# EAGLE design PCB_Schematic_ECE477 (EAGLE 7.4.0)
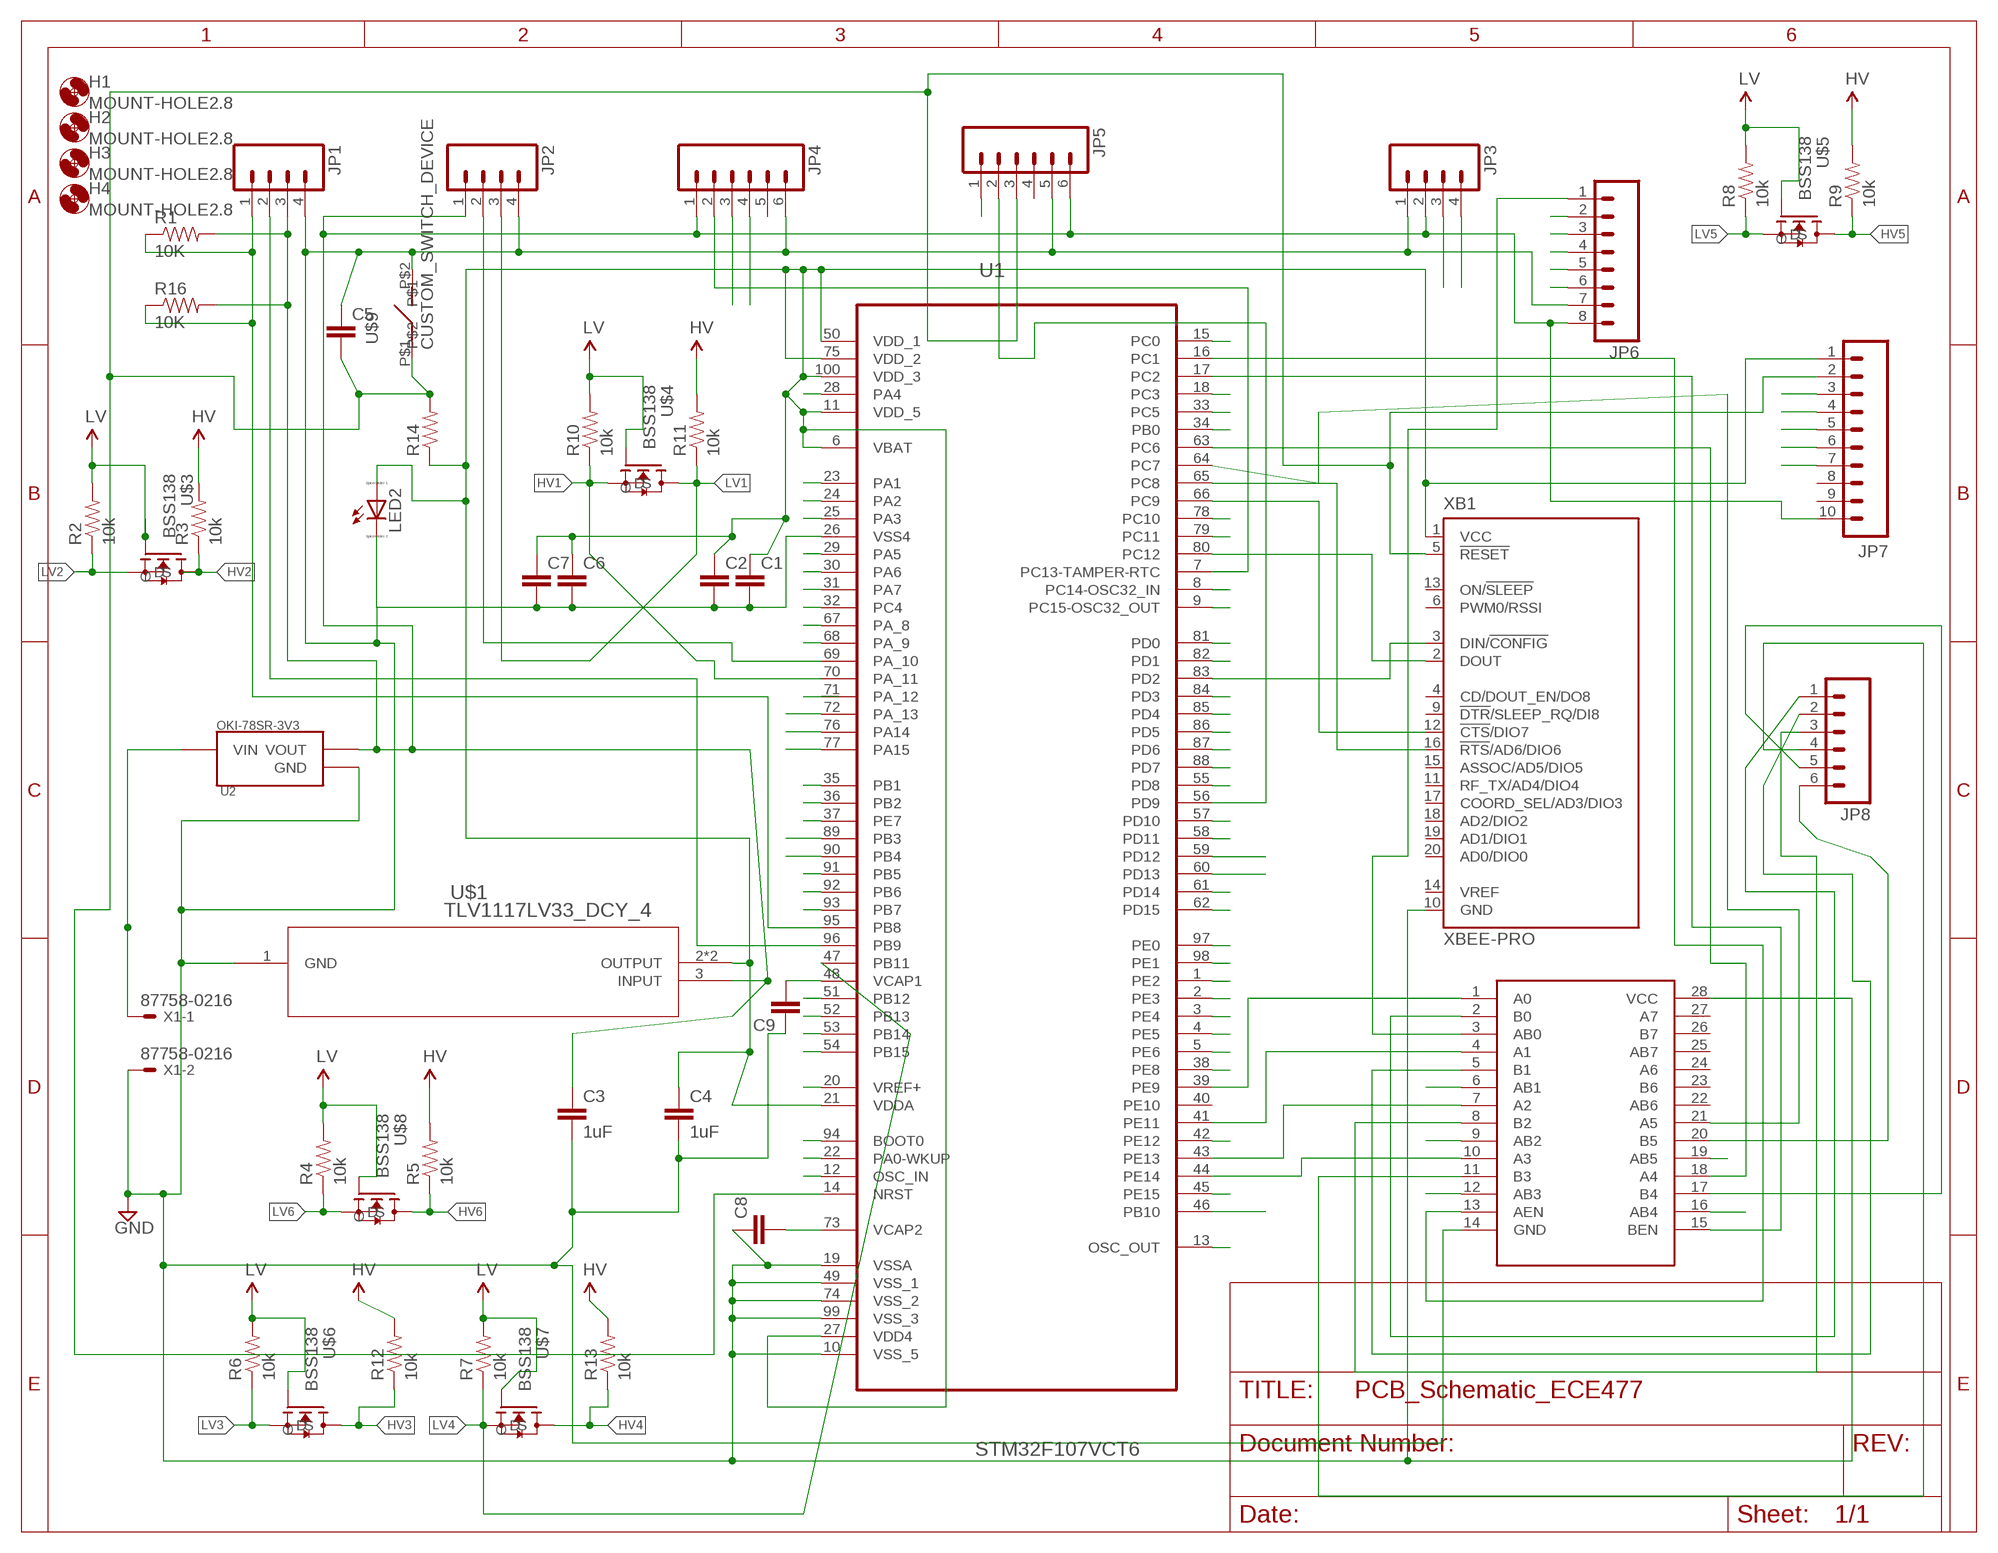
[diagram p0: schematic, sheet 1]

## Parts
C1  CAP1206  [1206]
C2  CAP1206  [1206]
C3  1uF  CAP1206  [1206]
C4  1uF  CAP1206  [1206]
C5  CAP1206  [1206]
C6  CAP1206  [1206]
C7  CAP1206  [1206]
C8  CAP1206  [1206]
C9  CAP1206  [1206]
H1  MOUNT-HOLE2.8  [2,8]
H2  MOUNT-HOLE2.8  [2,8]
H3  MOUNT-HOLE2.8  [2,8]
H4  MOUNT-HOLE2.8  [2,8]
JP1  M04PTH  [1X04]
JP2  M04PTH  [1X04]
JP3  M04PTH  [1X04]
JP4  M06SILK_FEMALE_PTH  [1X06]
JP5  M06SILK_FEMALE_PTH  [1X06]
JP6  M08SILK_FEMALE_PTH  [1X08]
JP7  M10SILK_FEMALE_PTH  [1X10]
JP8  M06SILK_FEMALE_PTH  [1X06]
LED2  LED_E  [LED_1206]
R1  10K  RESISTOR1206  [1206]
R2  10k  RESISTOR1206  [1206]
R3  10k  RESISTOR1206  [1206]
R4  10k  RESISTOR1206  [1206]
R5  10k  RESISTOR1206  [1206]
R6  10k  RESISTOR1206  [1206]
R7  10k  RESISTOR1206  [1206]
R8  10k  RESISTOR1206  [1206]
R9  10k  RESISTOR1206  [1206]
R10  10k  RESISTOR1206  [1206]
R11  10k  RESISTOR1206  [1206]
R12  10k  RESISTOR1206  [1206]
R13  10k  RESISTOR1206  [1206]
R14  RESISTOR1206  [1206]
R16  10K  RESISTOR1206  [1206]
U1  STM32F107VCT6  [QFP50P1600X1600X160-100N]
U2  OKI-78SR_3V3_SMPS  [SMPS_MODULE]
U$1  TLV1117LV33_DCY_4  [DCY4]
U$2  MUX_DEVMUX_VAR_1  [QSOP28]
U$3  BSS138  [BSS138]
U$4  BSS138  [BSS138]
U$5  BSS138  [BSS138]
U$6  BSS138  [BSS138]
U$7  BSS138  [BSS138]
U$8  BSS138  [BSS138]
U$9  CUSTOM_SWITCH_DEVICE  [CUSTOM_SWITCH_PACKAGE]
X1  87758-0216  [87758-0216]
XB1  XBEE-PRO  [XBEE-PRO]

## Nets
GND: C1.2 C2.2 C3.2 C4.2 C5.1 C6.2 C7.2 C8.1 C9.1 JP1.4 JP2.4 JP3.1 JP4.6 JP5.5 JP6.7 LED2.C U1.10(VSS_5) U1.19(VSSA) U1.26(VSS4) U1.49(VSS_1) U1.74(VSS_2) U1.99(VSS_3) U2.GND U$1.1(GND) U$2.14(GND) U$2.28(VCC) U$9.P$2 X1.2 XB1.10(GND)
HV: C3.1 JP1.3 JP2.1 JP3.2 JP4.1 JP5.6 JP6.8 JP7.10 R1.2 R3.2 R5.2 R9.2 R11.2 R12.2 R13.2 R16.2 U2.VOUT U$1.3(INPUT)
HV1: R10.1 U1.70(PA_11) U$4.S
HV2: JP3.3 R3.1 U$3.D
HV3: JP4.3 R12.1 U$6.D
HV4: JP4.4 R13.1 U$7.D
HV5: JP5.1 R9.1 U$5.D
HV6: JP3.4 R5.1 U$8.D
LV: R2.2 R4.2 R6.2 R7.2 R8.2 R10.2 U$3.G U$4.G U$5.G U$6.G U$7.G U$8.G
LV1: JP2.3 R11.1 U$4.D
LV2: R2.1 U1.59(PD12) U$3.S
LV3: R6.1 U1.46(PB10) U$6.S
LV4: R7.1 U1.47(PB11) U$7.S
LV5: R8.1 U1.55(PD8) U$5.S
LV6: R4.1 U1.60(PD13) U$8.S
N$1: C8.2 U1.73(VCAP2)
N$2: JP2.2 U1.69(PA_10)
N$3: JP6.6 U$2.19(AB5)
N$4: JP1.2 U1.96(PB9)
N$5: JP6.2 U$2.6(AB1)
N$6: JP6.3 U$2.9(AB2)
N$7: JP1.1 R1.1 R16.1 U1.95(PB8)
N$8: JP5.2 U1.56(PD9)
N$9: JP4.2 U1.7(PC13-TAMPER-RTC)
N$10: C9.2 U1.48(VCAP1)
N$10_NTJRST: JP7.7 U1.90(PB4)
N$10_TCLK: JP7.6 U1.76(PA14)
N$10_TDI: JP7.3 U1.77(PA15)
N$10_TDO: JP7.5 U1.89(PB3)
N$10_TMS: JP7.4 U1.72(PA_13)
N$11: U2.VIN X1.1
N$12: U1.23(PA1)
N$13: U1.24(PA2)
N$14: U1.80(PC12) XB1.2(DOUT)
N$15: U1.25(PA3)
N$16: U1.66(PC9) XB1.12(!CTS!/DIO7)
N$17: U1.65(PC8) XB1.16(!RTS!/AD6/DIO6)
N$18: U1.83(PD2) XB1.3(DIN/!CONFIG)
N$19: U1.29(PA5)
N$20: U1.16(PC1) U$2.13(AEN)
N$21: U1.17(PC2) U$2.15(BEN)
N$22: U1.39(PE9) U$2.1(A0)
N$23: U1.41(PE11) U$2.4(A1)
N$24: U1.43(PE13) U$2.7(A2)
N$25: U1.30(PA6)
N$26: U1.44(PE14) U$2.10(A3)
N$27: U1.63(PC6) U$2.18(A4)
N$28: U1.64(PC7) U$2.21(A5)
N$29: JP8.1 U$2.2(B0)
N$30: JP8.2 U$2.5(B1)
N$31: JP8.3 U$2.8(B2)
N$32: JP8.4 U$2.11(B3)
N$33: JP8.5 U$2.17(B4)
N$34: JP8.6 U$2.20(B5)
N$35: JP6.1 U$2.3(AB0)
N$36: U1.31(PA7)
N$37: U1.32(PC4)
N$38: U1.67(PA_8)
N$39: U1.68(PA_9)
N$41: JP6.4 U$2.12(AB3)
N$42: JP6.5 U$2.16(AB4)
N$43: U1.35(PB1)
N$44: U1.36(PB2)
N$45: U1.37(PE7)
N$46: U1.91(PB5)
N$47: U1.92(PB6)
N$48: U1.93(PB7)
N$49: U1.51(PB12)
N$50: U1.52(PB13)
N$51: U1.53(PB14)
N$52: U1.54(PB15)
N$53: U1.20(VREF+)
N$54: U1.94(BOOT0)
N$55: U1.22(PA0-WKUP)
N$56: U1.12(OSC_IN)
N$57: U1.13(OSC_OUT)
N$58: U1.45(PE15)
N$59: U1.42(PE12)
N$60: U1.38(PE8)
N$61: U1.5(PE6)
N$62: U1.4(PE5)
N$63: U1.3(PE4)
N$64: U1.2(PE3)
N$65: U1.1(PE2)
N$66: U1.98(PE1)
N$67: U1.97(PE0)
N$68: U1.62(PD15)
N$69: U1.61(PD14)
N$70: U1.58(PD11)
N$71: U1.57(PD10)
N$72: U1.88(PD7)
N$73: U1.87(PD6)
N$74: U1.86(PD5)
N$75: U1.85(PD4)
N$76: U1.84(PD3)
N$77: U1.82(PD1)
N$78: U1.81(PD0)
N$79: U1.9(PC15-OSC32_OUT)
N$80: U1.8(PC14-OSC32_IN)
N$81: U1.79(PC11)
N$82: U1.78(PC10)
N$83: U1.34(PB0)
N$84: U1.33(PC5)
N$85: U1.18(PC3)
N$86: U1.15(PC0)
N$87: U1.28(PA4)
RESET_OUT: C5.2 JP5.3 JP7.2 R14.2 U1.14(NRST) U$9.P$1 XB1.5(!RESET)
VIN_MICRO_3.3: C1.1 C2.1 C4.1 C6.1 C7.1 JP7.1 LED2.A R14.1 U1.6(VBAT) U1.11(VDD_5) U1.21(VDDA) U1.27(VDD4) U1.50(VDD_1) U1.75(VDD_2) U1.100(VDD_3) U$1.2(OUTPUT) U$1.4(OUTPUT) XB1.1(VCC)
Unconnected: JP4.5 JP5.4 JP7.8 JP7.9 U1.40(PE10) U1.71(PA_12) U$2.22(AB6) U$2.23(B6) U$2.24(A6) U$2.25(AB7) U$2.26(B7) U$2.27(A7) XB1.4(CD/DOUT_EN/DO8) XB1.6(PWM0/RSSI) XB1.9(!DTR!/SLEEP_RQ/DI8) XB1.11(RF_TX/AD4/DIO4) XB1.13(ON/!SLEEP) XB1.14(VREF) XB1.15(ASSOC/AD5/DIO5) XB1.17(COORD_SEL/AD3/DIO3) XB1.18(AD2/DIO2) XB1.19(AD1/DIO1) XB1.20(AD0/DIO0)

## Library data of the parts
C1-C9 = SparkFun-Passives:CAP: Capacitor Standard 0603 ceramic capacitor, and 0.1" leaded capacitor.
H1-H4 = holes:MOUNT-HOLE: MOUNTING HOLE with drill center marker
JP1-JP3 = SparkFun-Connectors:M04: Header 4 Standard 4-pin 0.1" header. Use with straight break away headers (SKU : PRT-00116), right angle break away headers (PRT-00553), swiss pins (PRT-00743), machine pins (PRT-00117), and female headers (PRT-00115). Molex polarized connector foot print use with SKU : PRT-08231 with associated crimp pins and housings. 1MM SMD Version SKU: PRT-10208
JP4 JP5 JP8 = SparkFun-Connectors:M06: Header 6 Standard 6-pin 0.1" header. Use with straight break away headers (SKU : PRT-00116), right angle break away headers (PRT-00553), swiss pins (PRT-00743), machine pins (PRT-00117), and female headers (PRT-00115). Molex polarized connector foot print use with SKU : PRT-08094 with associated crimp pins and housings. NOTES ON THE VARIANTS LOCK and LOCK_LONGPADS... This footprint was designed to help hold the alignment of a through-hole component (i.e. 6-pin header) while soldering it into place. You may notice that each hole has been shifted either up or down by 0.005 of an inch from it's more standard position (which is a perfectly straight line). This slight alteration caused the pins (the squares in the middle) to touch the edges of the holes. Because they are alternating, it causes a "brace" to hold the component in place. 0.005 has proven to be the perfect amount of "off-center" position when using our standard breakaway headers. Although looks a little odd when you look at the bare footprint, once you have a header in there, the alteration is very hard to notice. Also,if you push a header all the way into place, it is covered up entirely on the bottom side. This idea of altering the position of holes to aid alignment will be further integrated into the Sparkfun Library for other footprints. It can help hold any component with 3 or more connection pins.; PROD_ID: CONN-08437
JP6 = SparkFun-Connectors:M08: Header 8 Standard 8-pin 0.1" header. Use with straight break away headers (SKU : PRT-00116), right angle break away headers (PRT-00553), swiss pins (PRT-00743), machine pins (PRT-00117), and female headers (PRT-00115).; PROD_ID: CONN-08438
JP7 = SparkFun-Connectors:M10: Header 10 Standard 10-pin 0.1" header. Use with straight break away headers (SKU : PRT-00116), right angle break away headers (PRT-00553), swiss pins (PRT-00743), machine pins (PRT-00117), and female headers (PRT-00115).; PROD_ID: CONN-11563
LED2 = eagle-ltspice:LED_E: LED Source: http://www.osram.convergy.de Source: www.luxeon.com Source: www.kingbright.com; SPICEMODEL: NONE; SPICEPREFIX: D; SPICETYPE: diode
R1-R14 R16 = SparkFun-Resistors:RESISTOR: Resistor Basic schematic elements and footprints for 0603, 1206, and PTH resistors.
U1 = ST Microelctronics_By_element14_Batch_1:STM32F107VCT6: ARM-based 32-bit MCU; MPN: STM32F107VCT6; OC_FARNELL: 1737141; OC_NEWARK: 25R9446; PACKAGE: LQFP-100; SUPPLIER: STMicroelectronics
U2 = OKI-78SR_3V3_SMPS:OKI-78SR_3V3_SMPS
U$1 = TLV1117LV33_DCY_4:TLV1117LV33_DCY_4; DATASHEETURL: http://www.ti.com/lit/gpn/TLV1117LV33; DESCRIPTION: 1A, Positive Fixed Voltage Low-Dropout Linear Regulator; FAMILY_NAME: SINGLE CHANNEL LDO; GENERIC_PART_NUMBER: TLV1117LV33; INDUSTRY_STD_PKG_TYPE: SOT-223; MANUFACTURER: Texas Instruments; MANUFACTURER_PART_NUMBER: tlv1117lv33_dcy_4; PACKAGE_DESIGNATOR: DCY; PIN_COUNT: 4; VENDOR: Texas Instruments
U$2 = QSOP28:MUX_DEV
U$3-U$8 = BSS138:BSS138: BSS138 N-Channel Logic Level Enhancement Mode Field Effect Transistor
U$9 = custom_switch:CUSTOM_SWITCH_DEVICE
X1 = con-molex:87758-0216: 2 Pin - 2mm Dual Row Single Wafer, Vertical T/H HDR Source: http://www.molex.com/pdm_docs/sd/877580616_sd.pdf; MPN: 87758-0216; OC_FARNELL: unknown; OC_NEWARK: 94M1513
XB1 = maxstream:XBEE: XBee (TM) /XBee-PRO(TM) OEM RF Modules Source: MaxStream, Inc. xbee_productmanual.pdf; MPN: XBP24-AWI-001; OC_FARNELL: 1337916; OC_NEWARK: 42M2667

## Board
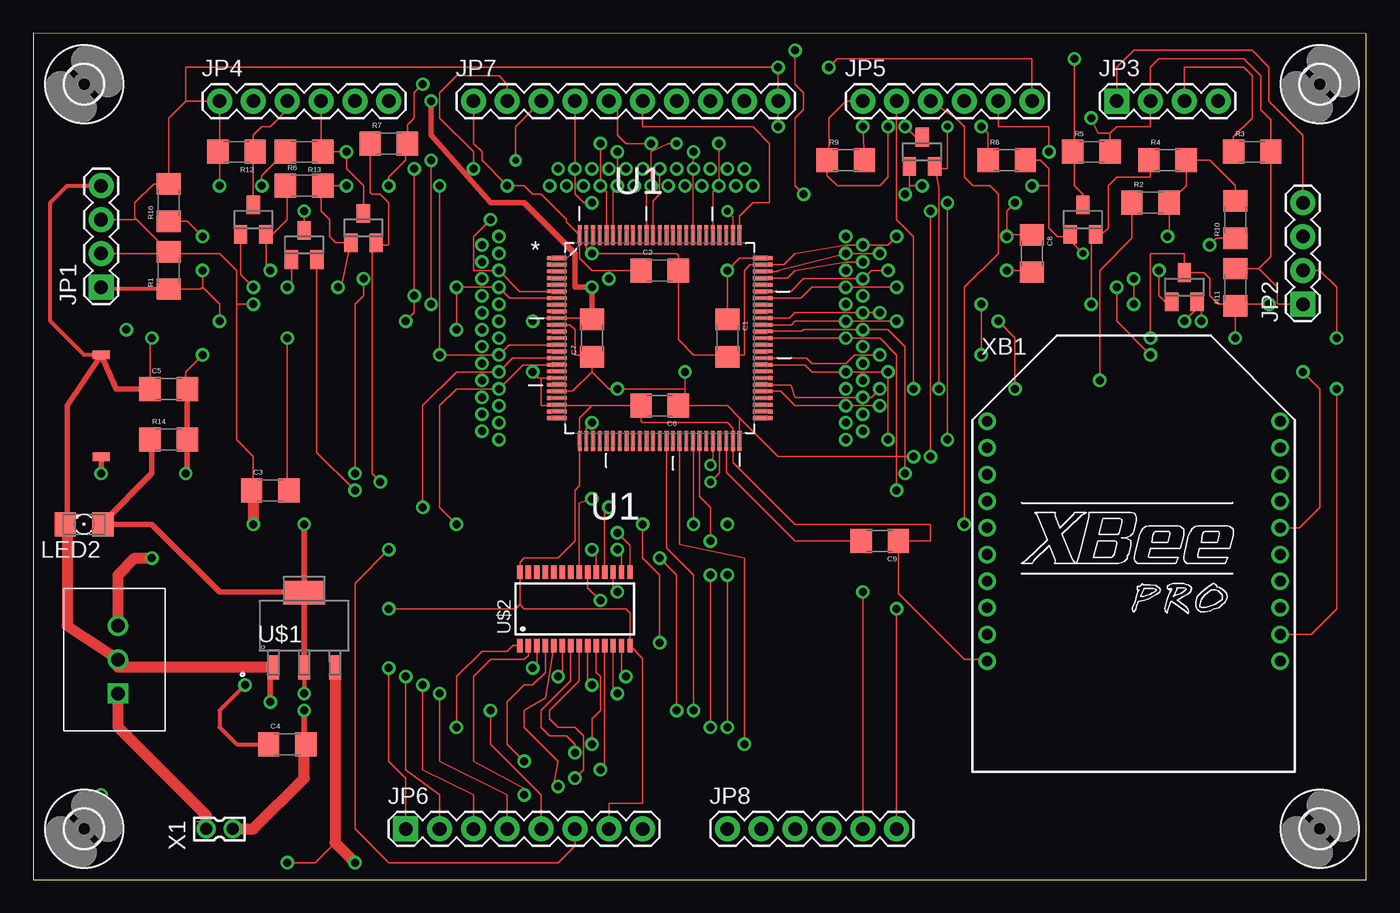
[diagram p1: board, top side]
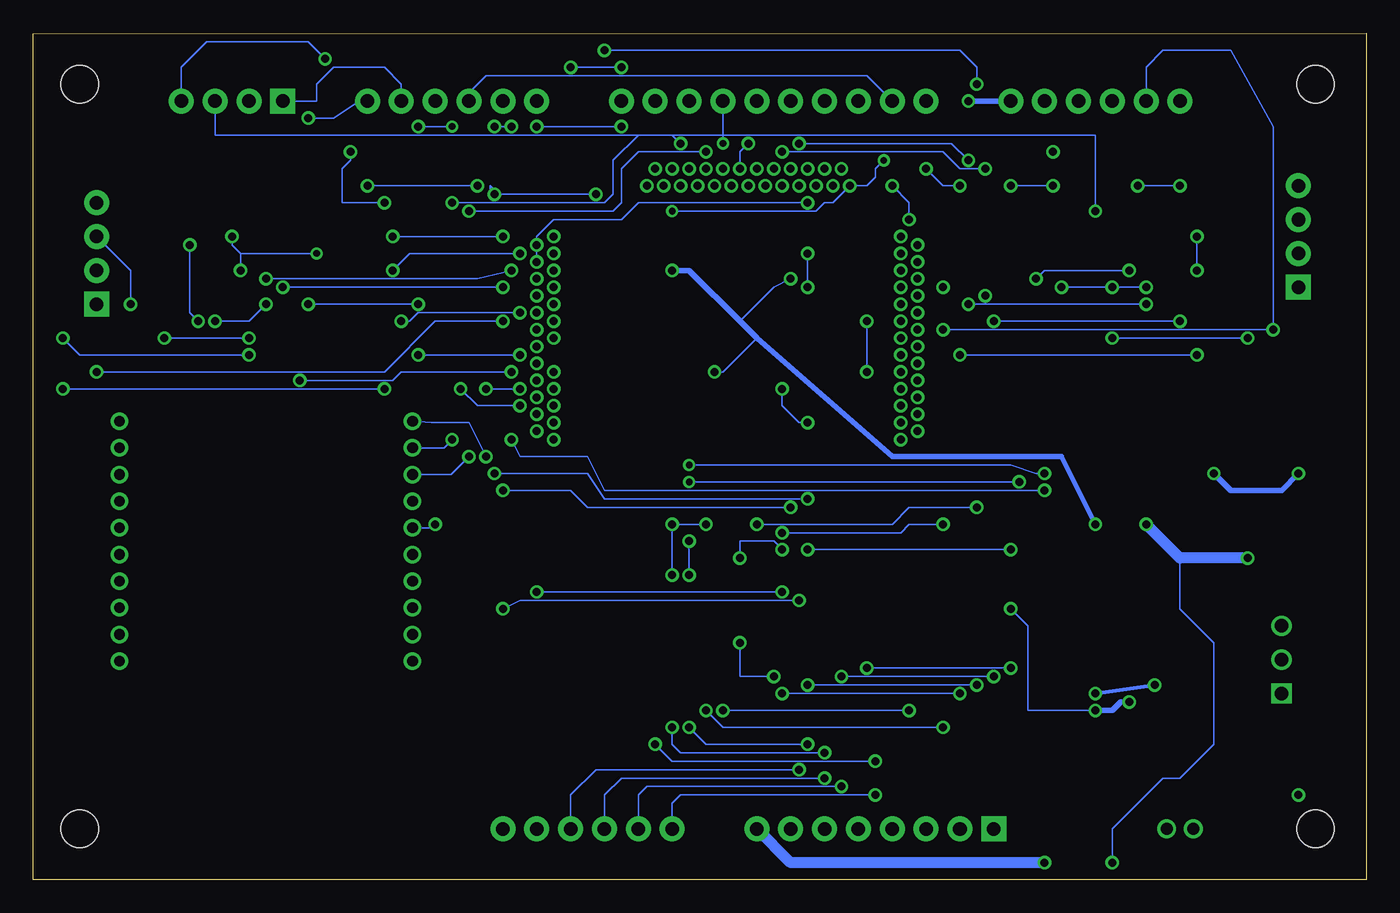
[diagram p2: board, bottom side, seen from below]

Size 100 x 63.51 mm. Coordinates in mm from the lower left corner, seen from the top.
Outline: 0,0 100,0 100,63.49 0,63.51 0,0
Copper layers (1*16): Top 0.035mm / dielectric 1.5mm / Bottom 0.035mm
Design rules "default": minimum track width 10mil, minimum drill 24mil, track to track 8mil, track to pad 8mil, pad to pad 8mil, via to via 8mil, smd to smd 8mil, copper to edge 40mil, drill to drill 8mil, minimum pad ring 10mil, minimum via ring 8mil, stop-mask expansion 4mil, vias tented up to drill 0mil, thermal gap 10mil

### Footprints (pad centres in the part's own frame; a part is rotated, then mirrored left to right if it is on the bottom)
1206 = smd 1.6 x 1.8: 1 -1.4,0; 2 1.4,0
2,8 = hole 2.8: 0,0
1X04 = drill 1.016 pad 1.88 square: 1 0,0 | drill 1.016 pad 1.88: 2 2.54,0; 3 5.08,0; 4 7.62,0
1X06 = drill 1.016 pad 1.88: 1 0,0; 2 2.54,0; 3 5.08,0; 4 7.62,0; 5 10.16,0; 6 12.7,0
1X08 = drill 1.016 pad 1.88 square: 1 0,0 | drill 1.016 pad 1.88: 2 2.54,0; 3 5.08,0; 4 7.62,0; 5 10.16,0; 6 12.7,0; 7 15.24,0; 8 17.78,0
1X10 = drill 1.016 pad 1.88: 1 0,0; 2 2.54,0; 3 5.08,0; 4 7.62,0; 5 10.16,0; 6 12.7,0; 7 15.24,0; 8 17.78,0; 9 20.32,0; 10 22.86,0
LED_1206 = smd 1.6 x 1.803: A -1.422,0; C 1.422,0
QFP50P1600X1600X160-100N = smd 1.473 x 0.279: 1 -7.722,5.994; 2 -7.722,5.512; 3 -7.722,5.004; 4 -7.722,4.496; 5 -7.722,3.988; 6 -7.722,3.505; 7 -7.722,2.997; 8 -7.722,2.489; 9 -7.722,2.007; 10 -7.722,1.499; 11 -7.722,0.991; 12 -7.722,0.508; 13 -7.722,0; 14 -7.722,-0.508; 15 -7.722,-0.991; 16 -7.722,-1.499; 17 -7.722,-2.007; 18 -7.722,-2.489; 19 -7.722,-2.997; 20 -7.722,-3.505; 21 -7.722,-3.988; 22 -7.722,-4.496; 23 -7.722,-5.004; 24 -7.722,-5.512; 25 -7.722,-5.994; 51 7.722,-5.994; 52 7.722,-5.512; 53 7.722,-5.004; 54 7.722,-4.496; 55 7.722,-3.988; 56 7.722,-3.505; 57 7.722,-2.997; 58 7.722,-2.489; 59 7.722,-2.007; 60 7.722,-1.499; 61 7.722,-0.991; 62 7.722,-0.508; 63 7.722,0; 64 7.722,0.508; 65 7.722,0.991; 66 7.722,1.499; 67 7.722,2.007; 68 7.722,2.489; 69 7.722,2.997; 70 7.722,3.505; 71 7.722,3.988; 72 7.722,4.496; 73 7.722,5.004; 74 7.722,5.512; 75 7.722,5.994 | smd 0.279 x 1.473: 26 -5.994,-7.722; 27 -5.512,-7.722; 28 -5.004,-7.722; 29 -4.496,-7.722; 30 -3.988,-7.722; 31 -3.505,-7.722; 32 -2.997,-7.722; 33 -2.489,-7.722; 34 -2.007,-7.722; 35 -1.499,-7.722; 36 -0.991,-7.722; 37 -0.508,-7.722; 38 0,-7.722; 39 0.508,-7.722; 40 0.991,-7.722; 41 1.499,-7.722; 42 2.007,-7.722; 43 2.489,-7.722; 44 2.997,-7.722; 45 3.505,-7.722; 46 3.988,-7.722; 47 4.496,-7.722; 48 5.004,-7.722; 49 5.512,-7.722; 50 5.994,-7.722; 76 5.994,7.722; 77 5.512,7.722; 78 5.004,7.722; 79 4.496,7.722; 80 3.988,7.722; 81 3.505,7.722; 82 2.997,7.722; 83 2.489,7.722; 84 2.007,7.722; 85 1.499,7.722; 86 0.991,7.722; 87 0.508,7.722; 88 0,7.722; 89 -0.508,7.722; 90 -0.991,7.722; 91 -1.499,7.722; 92 -2.007,7.722; 93 -2.489,7.722; 94 -2.997,7.722; 95 -3.505,7.722; 96 -3.988,7.722; 97 -4.496,7.722; 98 -5.004,7.722; 99 -5.512,7.722; 100 -5.994,7.722
SMPS_MODULE = drill 1: GND 0,0; VOUT 2.54,0 | drill 1 square: VIN -2.54,0
DCY4 = smd 0.889 x 1.778: 1 -2.311,-3.118; 2 0,-3.118; 3 2.311,-3.118 | smd 3.15 x 1.778: 4 0,2.483
QSOP28 = smd 0.4 x 1: 1 -4.128,-2.75; 2 -3.493,-2.75; 3 -2.858,-2.75; 4 -2.223,-2.75; 5 -1.587,-2.75; 6 -0.952,-2.75; 7 -0.317,-2.75; 8 0.318,-2.75; 9 0.953,-2.75; 10 1.588,-2.75; 11 2.223,-2.75; 12 2.858,-2.75; 13 3.493,-2.75; 14 4.128,-2.75; 15 4.128,2.75; 16 3.493,2.75; 17 2.858,2.75; 18 2.223,2.75; 19 1.588,2.75; 20 0.953,2.75; 21 0.318,2.75; 22 -0.317,2.75; 23 -0.952,2.75; 24 -1.587,2.75; 25 -2.223,2.75; 26 -2.858,2.75; 27 -3.493,2.75; 28 -4.128,2.75
BSS138 = smd 1 x 1.4: D 0,1.1; G -0.95,-1.1; S 0.95,-1.1
CUSTOM_SWITCH_PACKAGE = smd 0.635 x 1.27: P$1 -3.81,0; P$2 3.81,0
87758-0216 = drill 0.9 pad 1.27: 1 0,-1; 2 0,1
XBEE-PRO = drill 0.8 pad 1.27: 1 -11,9; 2 -11,7; 3 -11,5; 4 -11,3; 5 -11,1; 6 -11,-1; 7 -11,-3; 8 -11,-5; 9 -11,-7; 10 -11,-9; 11 11,-9; 12 11,-7; 13 11,-5; 14 11,-3; 15 11,-1; 16 11,1; 17 11,3; 18 11,5; 19 11,7; 20 11,9

### Placement (x,y rotation side)
C1  52.07,40.64 270 top
C2  46.99,45.72 0 top
C3  17.78,29.21 0 top
C4  19.05,10.16 0 top
C5  10.16,36.83 0 top
C6  46.99,35.56 180 top
C7  41.91,40.64 90 top
C8  74.93,46.99 270 top
C9  63.5,25.4 180 top
H1  3.81,59.69 0 top
H2  3.81,3.81 0 top
H3  96.52,59.69 0 top
H4  96.52,3.81 0 top
JP1  5.08,44.45 90 top
JP2  95.25,43.18 90 top
JP3  81.28,58.42 0 top
JP4  13.97,58.42 0 top
JP5  62.23,58.42 0 top
JP6  27.94,3.81 0 top
JP7  33.02,58.42 0 top
JP8  52.07,3.81 0 top
LED2  3.81,26.67 180 top
R1  10.16,45.72 90 top
R2  83.82,50.8 0 top
R3  91.44,54.61 0 top
R4  85.09,53.98 0 top
R5  79.38,54.61 0 top
R6  20.32,52.07 0 top
R7  26.67,55.24 0 top
R8  73.03,53.98 0 top
R9  60.96,53.98 0 top
R10  90.17,49.53 90 top
R11  90.17,44.45 90 top
R12  15.24,54.61 180 top
R13  20.32,54.61 180 top
R14  10.16,33.02 0 top
R16  10.16,50.8 90 top
U1  46.99,40.64 0 top
U2  6.35,16.51 90 top
U$1  20.32,19.05 0 top
U$2  40.64,20.32 0 top
U$3  20.32,47.62 0 top
U$4  86.36,44.45 0 top
U$5  66.67,54.61 0 top
U$6  16.51,49.53 0 top
U$7  24.77,48.9 0 top
U$8  78.74,49.53 0 top
U$9  5.08,35.56 90 top
X1  13.97,3.81 270 top
XB1  82.55,25.4 0 top

### Tracks (layer width: path | path; a pad name or v marks a point on that pad's centre or on a via)
GND  (via drill 0.6)
  Top 0.127: JP6.7 43.18,5.71 45.72,5.71 45.72,16.62 U$2.14 44.77,20 44.45,20.32 36.83,20.32 36.51,20.64 | C5.1 8.76,40.51 v8.89,40.64 | v19.05,40.64 19.05,29.34 C3.2 | C7.2 41.81,42.14 U1.10 37.69,42.14 v37.47,41.91 | U1.99 41.48,47.42 v41.91,46.99 48.26,46.99 48.39,46.86 C2.2 48.39,40.51 49.53,39.37 51.94,39.37 C1.2 52.2,39.37 53.34,39.37 53.34,45.72 53.77,46.15 U1.74 56.31,46.15 57.15,46.99 60.96,47.62 64.14,47.62 v64.77,48.26 | 41.91,35.56 C6.2 45.59,34.42 45.72,34.29 52.07,34.29 52.5,33.86 U1.49 52.5,31.32 57.15,26.67 67.31,26.67 67.31,25.4 C9.1 64.9,21.46 69.85,16.51 71.44,16.51 XB1.10 | 41.91,35.56 41,34.65 U1.26 41,29.57 40.64,29.21 40.64,25.4 39.37,24.13 36.83,24.13 36.51,23.81 U$2.28 36.51,20.64 | v26.67,20.32 36.19,20.32 36.51,20.64 | JP2.4 95.25,55.88 92.71,58.42 92.71,60.96 91.44,62.23 82.55,62.23 81.28,60.96 JP3.1 | v73.66,50.8 73.03,50.16 v73.03,48.26 73.16,48.39 C8.1 | v76.2,54.61 76.2,56.52 72.39,56.52 JP5.5 | U1.19 38.1,37.64 | 38.1,37.64 37.92,37.64 v37.47,38.1 | 41.91,35.56 38.1,35.56 38.1,37.64
  Top 0.305: U$9.P$2 3.81,39.37 1.27,41.91 1.27,50.8 2.54,52.07 JP1.4
  Top 0.406: 17.78,15.93 v17.78,13.34 | C4.2 20.32,10.16 v20.32,12.7 | 2.54,26.67 2.54,35.56 U$9.P$2 6.22,36.83 C5.1 | v29.84,58.42 29.84,55.88 34.29,50.8 36.83,50.8 40.64,46.99 40.64,44.45 v41.91,44.45 C7.2
  Top 0.813: U$1.1 17.78,15.93 6.35,15.93 U2.GND 2.54,19.05 2.54,26.67 LED2.C | X1.2 16.51,3.81 20.32,7.62 20.32,10.03 C4.2
  Bottom 0.127: v8.89,40.64 v19.05,40.64 | v41.91,46.99 v41.91,44.45 | v20.32,12.7 25.4,12.7 25.4,19.05 v26.67,20.32 | v64.77,48.26 v73.03,48.26 | JP3.1 78.74,58.42 78.74,59.69 77.47,60.96 73.66,60.96 72.39,59.69 JP5.5 | v73.66,50.8 76.83,50.8 76.83,53.34 76.2,53.98 v76.2,54.61 | v37.47,38.1 v37.47,41.91
  Bottom 0.406: v17.78,13.34 18.41,13.34 19.05,12.7 v20.32,12.7 | JP4.6 v29.84,58.42
HV  (via drill 0.6)
  Top 0.127: JP1.3 7.75,49.53 | 7.75,49.53 R1.2 | 7.75,49.53 7.62,49.66 7.62,50.8 9.02,52.2 R16.2 10.16,57.15 11.43,58.42 | 10.16,46.99 13.97,46.99 15.24,45.72 15.24,33.02 16.51,31.75 16.51,29.34 C3.1 | v19.05,1.27 21.13,1.27 22.63,2.77 | R11.2 91.94,45.85 | 91.94,45.85 93.34,44.45 93.34,43.18 JP2.1 | 91.94,45.85 92.84,46.74 R3.2 92.84,57.02 92.08,57.78 92.08,60.33 90.81,61.59 84.45,61.59 83.82,60.96 JP3.2 83.82,56.52 81.28,56.52 80.78,56.01 | R5.2 80.78,56.01 | 80.78,56.01 79.88,56.01 v79.38,57.15 | 11.43,58.42 JP4.1 13.97,54.74 | 13.97,54.74 R12.2 | 11.43,58.42 11.43,60.96 v55.88,60.96 JP7.10 v55.88,56.52 | 13.97,54.74 v13.97,52.07 | v17.14,52.07 17.14,52.84 R13.2 | R9.2 v62.23,56.52 | JP5.6 74.93,61.59 60.33,61.59 v59.69,60.96
  Top 0.305: R1.2 10.16,46.99
  Top 0.813: U2.VOUT 6.35,22.86 7.62,24.13 v8.89,24.13 | C3.1 16.51,29.21 v16.51,26.67 | U$1.3 22.63,2.77 v24.13,1.27
  Bottom 0.127: 13.97,24.13 13.97,20.32 11.43,17.78 11.43,10.16 13.97,7.62 15.24,7.62 19.05,3.81 v19.05,1.27 | JP5.6 75.56,58.42 77.47,57.15 v79.38,57.15 | v13.97,52.07 v17.14,52.07 | v55.88,56.52 v62.23,56.52 | v59.69,60.96 v55.88,60.96
  Bottom 0.813: v8.89,24.13 13.97,24.13 v16.51,26.67 | v24.13,1.27 43.18,1.27 JP6.8
HV1  (via drill 0.6)
  Top 0.127: U1.70 56.84,44.15 57.78,45.09 62.23,45.09 62.87,45.72 v64.14,45.72 | v86.36,41.91 87.31,42.86 U$4.S 87.63,43.03 v87.63,41.91 | v82.55,43.18 v82.55,45.09 | R10.1 88.77,48.13 v88.27,47.62
  Bottom 0.127: v86.36,41.91 83.82,41.91 v82.55,43.18 | v82.55,45.09 66.67,45.09 v64.14,45.72 | v88.27,47.62 88.27,42.55 v87.63,41.91
HV2  (via drill 0.6)
  Top 0.127: R3.1 90.04,55.75 91.44,57.15 91.44,60.33 90.81,60.96 86.36,60.96 JP3.3 | v20.32,50.16 U$3.D
  Bottom 0.127: JP3.3 86.36,55.88 20.32,55.88 v20.32,50.16
HV3
  Top 0.127: JP4.3 19.05,57.78 17.78,56.52 17.14,56.52 16.51,55.88 16.51,54.74 R12.1 16.51,54.48 U$6.D
HV4  (via drill 0.6)
  Top 0.127: JP4.4 21.59,54.74 R13.1 v23.5,54.61 23.5,53.34 24.77,52.07 U$7.D
HV5  (via drill 0.6)
  Top 0.127: JP5.1 60.96,58.42 59.69,57.15 59.69,54.1 R9.1 59.56,52.84 60.33,52.07 63.5,52.07 64.14,52.7 v64.14,56.52 | U$5.D 66.21,55.71 v65.41,56.52
  Bottom 0.127: v64.14,56.52 v65.41,56.52
HV6  (via drill 0.6)
  Top 0.127: U$8.D 78.74,51.44 78.11,52.07 78.11,53.84 R5.1 78.11,54.74 v78.11,61.59
  Bottom 0.127: JP3.4 88.9,60.96 87,62.87 79.38,62.87 v78.11,61.59
LV  (via drill 0.5, 0.6)
  Top 0.127: U$4.G 84.92,43.35 84.45,43.81 v84.45,45.72 | v85.09,48.26 85.22,48.39 R2.2 86.49,52.07 R4.2 88.27,53.98 90.17,52.07 R10.2 | v78.74,46.99 77.79,47.94 U$8.G 77.62,48.26 76.83,48.26 76.2,48.9 76.2,52.07 | R8.2 75.56,53.98 76.2,53.34 76.2,52.07 | U$6.G 15.56,45.4 v16.51,44.45 | U$3.G 19.37,44.77 v19.05,44.45 | v22.86,44.45 23.18,44.77 U$7.G 22.69,47.8 22.23,48.26 22.23,49.53 21.59,50.16 21.59,51.94 R6.2 v23.5,52.07 | v26.67,52.07 26.67,52.7 27.94,53.98 27.94,55.12 R7.2 28.07,56.65 28.57,57.15 28.57,59.05 v29.21,59.69 | v57.15,62.23 57.15,59.69 57.78,59.05 57.78,57.78 57.15,57.15 57.15,52.07 v57.78,51.44 | 65.72,52.07 U$5.G 65.72,52.38 | 65.72,52.07 65.72,51.76 v65.41,51.44 | 65.72,52.07 v66.67,52.07 | 76.2,52.07 v74.93,52.07
  Bottom 0.127: v85.09,48.26 85.09,47.62 84.45,46.99 | 84.45,46.99 v84.45,45.72 | v78.74,46.99 84.45,46.99 | v16.51,44.45 v19.05,44.45 v22.86,44.45 | v23.5,52.07 v26.67,52.07 | v29.21,59.69 29.21,60.96 30.48,62.23 v57.15,62.23 | v57.78,51.44 65.09,51.44 65.72,52.07 65.72,51.76 v65.41,51.44 | v66.67,52.07 v74.93,52.07
LV1  (via drill 0.6)
  Top 0.127: R11.1 v90.17,40.64 | v83.82,40.64 83.82,46.99 86.36,46.99 U$4.D 87.8,45.55 88.27,45.09 88.27,43.81 88.9,43.18 v92.71,43.18
  Bottom 0.127: v90.17,40.64 v83.82,40.64 | v92.71,43.18 92.71,45.72 JP2.3
LV2  (via drill 0.6)
  Top 0.127: U1.59 57.89,38.63 58.42,38.1 v64.14,38.1 v64.14,33.02 | U$3.S 21.27,32.07 v24.13,29.21 | R2.1 82.42,48.13 80.01,45.72 v80.01,37.47
  Bottom 0.127: v24.13,29.21 57.15,29.21 58.42,31.75 63.5,31.75 v64.14,33.02 | v80.01,37.47 73.03,37.47 72.39,38.1 v64.14,38.1
LV3  (via drill 0.5, 0.6)
  Top 0.127: U1.46 50.98,31.29 v50.8,31.11 | v17.78,45.72 17.46,46.04 U$6.S 17.95,48.43 19.05,49.53 19.05,51.94 R6.1 | v24.77,45.09 24.77,43.81 24.13,43.18 v24.13,30.48
  Bottom 0.127: v50.8,31.11 26.67,31.11 24.77,30.48 v24.13,30.48 | v17.78,45.72 24.13,45.72 v24.77,45.09
LV4  (via drill 0.5, 0.6)
  Top 0.127: U1.47 51.49,30.53 v50.8,29.84 | v26.04,29.84 25.4,30.48 25.4,47.48 U$7.S 25.89,47.62 26.67,47.62 26.67,50.8 26.04,51.44 25.4,51.44 25.27,51.56 R7.1
  Bottom 0.127: v50.8,29.84 v26.04,29.84
LV5  (via drill 0.5, 0.6)
  Top 0.127: U1.55 56.06,36.65 57.15,35.56 v63.5,35.56 | v67.94,36.83 67.94,51.92 U$5.S 67.8,53.34 68.58,53.34 v68.58,56.52 | R8.1 71.62,56.01 v71.12,56.52
  Bottom 0.127: v63.5,35.56 66.67,35.56 v67.94,36.83 | v71.12,56.52 v68.58,56.52
LV6  (via drill 0.6)
  Top 0.127: U1.60 58.01,39.14 58.42,38.73 60.96,38.73 61.59,39.37 v63.5,39.37 | v71.12,39.37 v71.12,43.18 | v79.38,43.18 79.38,48.12 U$8.S 80.18,48.43 80.64,48.9 80.64,52.07 81.28,52.7 83.82,52.7 83.82,53.84 R4.1
  Bottom 0.127: v63.5,39.37 v71.12,39.37 | v71.12,43.18 v79.38,43.18
N$1  (via drill 0.6)
  Top 0.127: U1.73 55.8,45.64 55.88,45.72 60.96,46.99 v63.5,46.99 | v73.03,45.72 74.8,45.72 C8.2
  Bottom 0.127: v63.5,46.99 71.75,46.99 v73.03,45.72
N$2  (via drill 0.6)
  Top 0.127: U1.69 57.61,43.64 58.42,44.45 v64.77,44.45 | v81.28,44.45 81.28,41.91 v83.82,39.37 | v97.79,40.64 97.79,44.45 96.52,45.72 JP2.2
  Bottom 0.127: v64.77,44.45 v81.28,44.45 | v83.82,39.37 96.52,39.37 v97.79,40.64
N$3  (via drill 0.6)
  Top 0.127: JP6.6 40.64,2.54 39.37,1.27 26.67,1.27 24.13,3.81 24.13,22.23 v26.67,24.77 | U$2.19 42.23,24.45 v41.91,24.77
  Bottom 0.127: v26.67,24.77 v41.91,24.77
N$4  (via drill 0.6)
  Top 0.127: JP1.2 13.97,46.99 15.24,45.72 15.24,43.18 v16.51,43.18 | U1.96 43,51.61 42.55,52.07 v42.55,55.24 | v29.84,43.18 v29.84,53.98
  Bottom 0.127: v16.51,43.18 v29.84,43.18 | v29.84,53.98 31.11,55.24 v42.55,55.24
N$5  (via drill 0.6)
  Top 0.127: JP6.2 30.48,6.35 27.94,8.26 v27.94,15.24 | v39.37,15.24 39.69,15.56 U$2.6
  Bottom 0.127: v27.94,15.24 v39.37,15.24
N$6  (via drill 0.6)
  Top 0.127: JP6.3 33.02,6.35 29.21,8.26 v29.21,14.61 | v41.91,14.61 41.59,14.92 U$2.9
  Bottom 0.127: v29.21,14.61 v41.91,14.61
N$7  (via drill 0.6)
  Top 0.127: R16.1 11.56,49.4 v12.7,48.26 | R1.1 12.57,44.32 12.7,44.45 | 12.7,44.45 v12.7,45.72 | U1.95 43.48,51.74 43.81,52.07 v43.81,54.61 | v27.94,41.91 28.57,42.55 v28.57,43.81 v28.57,53.34 | v13.97,41.91 13.97,43.18 12.7,44.45
  Top 0.305: R1.1 5.21,44.32 JP1.1
  Bottom 0.127: v12.7,48.26 v12.7,45.72 | v43.81,54.61 31.75,54.61 30.48,53.34 v28.57,53.34 | 28.57,43.18 v28.57,43.81 | v27.94,41.91 v13.97,41.91
N$8  (via drill 0.6)
  Top 0.127: U1.56 56.84,37.13 57.15,36.2 62.87,36.2 v63.5,36.83 | v66.04,36.83 66.04,48.26 64.77,49.53 JP5.2
  Bottom 0.127: v63.5,36.83 v66.04,36.83
N$9  (via drill 0.6)
  Top 0.127: U1.7 35.74,43.64 34.92,44.45 v31.75,44.45 v31.75,41.27
  Bottom 0.127: v31.75,41.27 v6.99,41.27 6.99,56.52 10.16,62.23 15.24,62.23 16.51,60.96 JP4.2
N$10
  Top 0.127: U1.48 51.99,30.56 57.15,25.4 C9.2
N$10_NTJRST  (via drill 0.5)
  Top 0.127: U1.90 46,51.71 46.35,52.07 46.35,54.61 47.62,55.24 v48.26,55.24
  Bottom 0.127: v48.26,55.24 JP7.7
N$10_TCLK
  Top 0.127: U1.76 52.98,49.81 53.98,50.8 55.24,50.8 55.24,55.24 53.98,56.52 45.72,56.52 JP7.6
N$10_TDI  (via drill 0.5)
  Top 0.127: U1.77 52.5,49.73 v52.07,50.16 | JP7.3 36.2,56.52 v36.2,53.98
  Bottom 0.127: v52.07,50.16 41.27,50.16 40.64,50.8 40.01,50.8 38.73,52.07 37.47,52.07 36.83,52.7 36.83,53.34 v36.2,53.98
N$10_TDO  (via drill 0.6)
  Top 0.127: U1.89 46.48,50.93 46.99,51.44 v46.99,53.34 | v46.35,55.24 44.45,55.24 43.81,55.88 43.81,57.78 JP7.5
  Bottom 0.127: v46.99,53.34 46.99,54.61 v46.35,55.24
N$10_TMS  (via drill 0.6)
  Top 0.127: U1.72 56.57,45.14 57.15,45.72 60.96,46.35 v62.23,46.35 | JP7.4 40.64,51.44 41.27,50.8 v41.91,50.8
  Bottom 0.127: v41.91,50.8 54.61,50.8 55.88,49.53 60.96,49.53 62.23,48.26 v62.23,46.35
N$11
  Top 0.813: X1.1 12.97,4.81 6.35,11.43 U2.VIN
N$14  (via drill 0.6)
  Top 0.127: U1.80 50.98,51.61 51.44,52.07 v51.44,55.24 | v68.58,33.02 v68.58,50.8
  Bottom 0.127: XB1.2 69.2,32.4 v68.58,33.02 | v68.58,50.8 57.15,50.8 56.52,51.44 56.52,53.98 54.61,55.88 52.07,55.88 v51.44,55.24
N$16  (via drill 0.6)
  Top 0.127: U1.66 56.74,42.14 57.15,42.55 v63.5,42.55 | XB1.12 95.87,18.4 97.79,20.32 v97.79,36.83 | v73.66,36.83 73.66,40.64 v72.39,41.91
  Bottom 0.127: v97.79,36.83 v73.66,36.83 | v72.39,41.91 71.75,41.91 71.12,42.55 v63.5,42.55
N$17  (via drill 0.6)
  Top 0.127: U1.65 56.87,41.63 57.15,41.91 v64.77,41.91 | XB1.16 94.98,26.4 96.52,27.94 96.52,36.83 v95.25,38.1
  Bottom 0.127: v95.25,38.1 73.66,38.1 69.85,41.91 v64.77,41.91
N$18  (via drill 0.6)
  Top 0.127: U1.83 49.48,53.29 v49.53,54.61 | v67.31,31.75 v67.31,50.16
  Bottom 0.127: XB1.3 68.66,30.4 v67.31,31.75 | v67.31,50.16 56.52,50.16 55.88,50.8 55.88,53.34 54.61,54.61 v49.53,54.61
N$20  (via drill 0.6)
  Top 0.127: U$2.13 44.13,15.56 v44.45,15.24 | v46.99,17.78 46.99,22.86 45.72,24.13 v45.72,26.67 | U1.16 35.97,39.14 34.92,38.1 31.75,38.1 29.21,35.56 v29.21,27.94
  Bottom 0.127: v44.45,15.24 46.99,15.24 v46.99,17.78 | v45.72,26.67 35.56,26.67 34.29,27.94 v29.21,27.94
N$21  (via drill 0.6)
  Top 0.127: U$2.15 44.77,25.08 v43.81,26.04 | U1.17 36.73,38.63 34.92,36.83 31.75,36.83 30.48,35.56 30.48,27.94 v31.75,26.67
  Bottom 0.127: v43.81,26.04 34.92,26.04 34.29,26.67 v31.75,26.67
N$22  (via drill 0.6)
  Top 0.127: U$2.1 35.98,17.57 35.56,17.14 33.66,17.14 31.75,15.24 v31.75,11.43 | U1.39 47.5,24.89 49.53,22.86 v49.53,12.7
  Bottom 0.127: v31.75,11.43 48.26,11.43 v49.53,12.7
N$23  (via drill 0.6)
  Top 0.127: U$2.4 38.42,15.56 37.47,14.61 36.83,14.61 35.56,13.34 35.56,10.16 v36.83,8.89 | U1.41 48.49,25.17 53.34,24.13 v53.34,10.16
  Bottom 0.127: v36.83,8.89 52.07,8.89 v53.34,10.16
N$24  (via drill 0.6)
  Top 0.127: U$2.7 40.32,14.92 38.1,12.7 38.1,11.43 38.73,10.79 40.01,10.79 40.64,10.16 v40.64,9.53 | v52.07,11.43 v52.07,22.86 | v49.53,26.67 49.53,32.87 U1.43
  Bottom 0.127: v40.64,9.53 51.44,9.53 52.07,10.16 v52.07,11.43 | v52.07,22.86 v52.07,26.67 v49.53,26.67
N$26  (via drill 0.6)
  Top 0.127: U$2.10 42.23,15.56 42.55,15.24 42.55,12.7 41.91,12.06 v41.91,10.16 | v50.8,11.43 v50.8,22.86 | v50.8,25.4 50.8,27.94 49.99,28.75 U1.44
  Bottom 0.127: v41.91,10.16 49.53,10.16 v50.8,11.43 | v50.8,22.86 v50.8,25.4
N$27  (via drill 0.6)
  Top 0.127: U1.63 63.5,40.64 64.77,39.37 v64.77,29.21 | U$2.18 42.86,27.62 v43.18,27.94
  Bottom 0.127: v43.18,27.94 58.42,27.94 59.69,29.21 v64.77,29.21
N$28  (via drill 0.6)
  Top 0.127: U1.64 57.66,41.15 57.78,41.27 64.14,41.27 65.41,40.01 v65.41,30.48 | U$2.21 40.96,28.26 v41.91,28.57
  Bottom 0.127: v41.91,28.57 57.15,28.57 58.42,30.48 v65.41,30.48
N$29  (via drill 0.6)
  Top 0.127: v36.83,6.35 37.15,6.67 33.02,8.89 33.02,15.24 34.29,16.51 36.83,16.51 37.15,16.83 U$2.2
  Bottom 0.127: JP8.1 52.07,5.71 51.44,6.35 v36.83,6.35
N$30  (via drill 0.6)
  Top 0.127: v39.37,6.99 39.05,7.3 39.37,8.89 36.83,11.43 36.83,12.7 38.42,13.65 U$2.5
  Bottom 0.127: JP8.2 54.61,6.35 53.98,6.99 v39.37,6.99
N$31  (via drill 0.6)
  Top 0.127: 40.96,7.94 v40.64,7.62 41.27,8.26 41.27,10.79 40.64,11.43 39.37,11.43 38.73,12.06 38.73,12.7 40.96,14.92 U$2.8
  Bottom 0.127: JP8.3 57.15,6.35 55.88,7.62 v40.64,7.62
N$32  (via drill 0.6)
  Top 0.127: v42.55,8.26 42.86,8.57 U$2.11
  Bottom 0.127: JP8.4 59.69,6.35 57.78,8.26 v42.55,8.26
N$33  (via drill 0.6)
  Top 0.127: U$2.17 43.5,21.91 v43.81,21.59 | v62.23,21.59 JP8.5
  Bottom 0.127: v43.81,21.59 v62.23,21.59
N$34  (via drill 0.6)
  Top 0.127: 42.23,21.27 v42.55,20.95 41.59,21.91 U$2.20 | JP8.6 v64.77,20.32
  Bottom 0.127: v42.55,20.95 63.5,20.95 v64.77,20.32
N$35  (via drill 0.6)
  Top 0.127: JP6.1 27.94,7.62 26.67,8.89 v26.67,15.88 | U$2.3 37.78,16.19 v37.47,15.88
  Bottom 0.127: v26.67,15.88 v37.47,15.88
N$41  (via drill 0.6)
  Top 0.127: JP6.4 35.56,6.35 30.48,8.89 v30.48,13.97 | v43.81,13.97 43.5,14.29 U$2.12
  Bottom 0.127: v30.48,13.97 v43.81,13.97
N$42  (via drill 0.6)
  Top 0.127: JP6.5 38.1,6.35 34.29,10.16 v34.29,12.7 | v48.26,12.7 48.26,22.86 v46.99,24.13 | U$2.16 44.13,24.45 v43.81,24.77
  Bottom 0.127: v34.29,12.7 v48.26,12.7 | v46.99,24.13 46.99,25.4 44.45,25.4 v43.81,24.77
N$88  (via drill 0.6)
  other vias: 17.14,52.07
N$113  (via drill 0.6)
  other vias: 5.08,6.35
N$114  (via drill 0.6)
  other vias: 34.92,48.26
N$115  (via drill 0.6)
  other vias: 34.92,46.99
N$116  (via drill 0.6)
  other vias: 34.92,45.72
N$117  (via drill 0.6)
  other vias: 60.96,33.02
N$118  (via drill 0.6)
  other vias: 60.96,34.29
N$119  (via drill 0.6)
  other vias: 60.96,35.56
N$120  (via drill 0.6)
  other vias: 60.96,36.83
N$121  (via drill 0.6)
  other vias: 60.96,38.1
N$123  (via drill 0.6)
  other vias: 60.96,40.64
N$124  (via drill 0.6)
  other vias: 60.96,41.91
N$125  (via drill 0.6)
  other vias: 60.96,43.18
N$126  (via drill 0.6)
  other vias: 60.96,44.45
N$127  (via drill 0.6)
  other vias: 60.96,45.72
N$128  (via drill 0.6)
  other vias: 60.96,46.99
N$129  (via drill 0.6)
  other vias: 60.96,48.26
N$130  (via drill 0.6)
  other vias: 34.92,44.45
N$131  (via drill 0.6)
  other vias: 34.92,43.18
N$132  (via drill 0.6)
  other vias: 34.92,41.91
N$133  (via drill 0.6)
  other vias: 34.92,40.64
N$134  (via drill 0.6)
  other vias: 62.23,34.92
N$135  (via drill 0.6)
  other vias: 62.23,36.2
N$136  (via drill 0.6)
  other vias: 62.23,37.47
N$137  (via drill 0.6)
  other vias: 62.23,38.73
N$138  (via drill 0.6)
  other vias: 62.23,40.01
N$139  (via drill 0.6)
  other vias: 62.23,41.27
N$140  (via drill 0.6)
  other vias: 62.23,42.55
N$141  (via drill 0.6)
  other vias: 62.23,43.81
N$142  (via drill 0.6)
  other vias: 62.23,45.09
N$144  (via drill 0.6)
  other vias: 62.23,47.62
N$145  (via drill 0.6)
  other vias: 62.23,33.66
N$146  (via drill 0.6)
  other vias: 34.92,39.37
N$147  (via drill 0.6)
  other vias: 34.92,38.1
N$148  (via drill 0.6)
  other vias: 34.92,36.83
N$149  (via drill 0.6)
  other vias: 34.92,35.56
N$150  (via drill 0.6)
  other vias: 34.92,34.29
N$151  (via drill 0.6)
  other vias: 34.92,33.02
N$152  (via drill 0.6)
  other vias: 33.66,33.66
N$153  (via drill 0.6)
  other vias: 33.66,34.92
N$154  (via drill 0.6)
  other vias: 33.66,36.2
N$155  (via drill 0.6)
  other vias: 33.66,37.47
N$156  (via drill 0.6)
  other vias: 33.66,38.73
N$157  (via drill 0.6)
  other vias: 33.66,40.01
N$158  (via drill 0.6)
  other vias: 33.66,41.27
N$159  (via drill 0.6)
  other vias: 33.66,42.55
N$160  (via drill 0.6)
  other vias: 33.66,43.81
N$161  (via drill 0.6)
  other vias: 33.66,45.09
N$162  (via drill 0.6)
  other vias: 33.66,46.35
N$163  (via drill 0.6)
  other vias: 33.66,47.62
N$164  (via drill 0.6)
  other vias: 38.73,52.07
N$165  (via drill 0.6)
  other vias: 40.01,52.07
N$166  (via drill 0.6)
  other vias: 41.27,52.07
N$167  (via drill 0.6)
  other vias: 42.55,52.07
N$168  (via drill 0.6)
  other vias: 43.81,52.07
N$169  (via drill 0.6)
  other vias: 45.09,52.07
N$170  (via drill 0.6)
  other vias: 46.35,52.07
N$171  (via drill 0.6)
  other vias: 47.62,52.07
N$172  (via drill 0.6)
  other vias: 48.9,52.07
N$173  (via drill 0.6)
  other vias: 50.16,52.07
N$174  (via drill 0.6)
  other vias: 51.44,52.07
N$175  (via drill 0.6)
  other vias: 52.7,52.07
N$176  (via drill 0.6)
  other vias: 53.98,52.07
N$177  (via drill 0.6)
  other vias: 39.37,53.34
N$178  (via drill 0.6)
  other vias: 40.64,53.34
N$179  (via drill 0.6)
  other vias: 41.91,53.34
N$180  (via drill 0.6)
  other vias: 43.18,53.34
N$181  (via drill 0.6)
  other vias: 44.45,53.34
N$182  (via drill 0.6)
  other vias: 45.72,53.34
N$184  (via drill 0.6)
  other vias: 48.26,53.34
N$185  (via drill 0.6)
  other vias: 49.53,53.34
N$186  (via drill 0.6)
  other vias: 50.8,53.34
N$187  (via drill 0.6)
  other vias: 52.07,53.34
N$188  (via drill 0.6)
  other vias: 53.34,53.34
RESET_OUT  (via drill 0.6)
  Top 0.127: U1.14 35.69,40.13 34.92,39.37 v30.48,39.37 v30.48,52.07 | v12.7,39.37 11.43,38.1 11.43,36.96 C5.2 | v69.85,26.67 69.85,44.45 72.39,46.99 72.39,51.44 71.75,52.07 70.48,52.07 69.85,52.7 69.85,56.52 69.22,57.15 JP5.3 | v33.02,53.34 33.02,54.61 30.48,57.15 30.48,59.05 31.75,60.33 34.92,60.33 35.56,59.69 JP7.2
  Top 0.406: U$9.P$1 v5.08,30.48 | v11.43,30.48 11.56,30.48 R14.2 C5.2
  Bottom 0.127: v30.48,39.37 v12.7,39.37 | XB1.5 70.12,26.4 v69.85,26.67 | JP5.3 67.31,59.05 66.04,60.33 37.47,60.33 JP7.2 | v30.48,52.07 31.75,52.07 v33.02,53.34
  Bottom 0.406: v5.08,30.48 6.35,29.21 10.16,29.21 v11.43,30.48
VIN_MICRO_3.3  (via drill 0.6)
  Top 0.127: U1.21 40.46,36.65 41.91,38.1 | 41.91,38.1 C7.1 41.78,39.37 40.64,39.37 40.64,41.27 40.28,41.63 U1.11 | U1.75 52.98,46.63 v52.07,45.72 C1.1 | 48.9,35.56 C6.1 48.26,35.56 | 48.9,35.56 52.07,35.56 52.98,34.65 | U1.27 41.48,33.86 v41.91,34.29 | 48.9,36.83 v43.81,36.83 43.18,36.83 41.91,38.1 | 48.9,36.83 48.9,35.56 | 48.9,36.83 v48.9,38.1 | C2.1 43.18,45.72 | 43.18,45.72 41.91,45.72 41,46.63 U1.100 40.01,49.35 40.01,49.53 38.1,51.44 37.47,51.44 36.83,52.07 v35.56,52.07 33.66,53.98 33.66,54.61 33.02,55.24 JP7.1 | 43.18,45.72 v43.18,45.09 | 52.98,34.65 55.88,31.75 v66.04,31.75 | 71.44,34.29 XB1.1 | U1.50 52.98,34.65 | U1.6 36.5,44.15 34.92,45.72 33.02,45.72 33.02,48.26 v34.29,49.53
  Top 0.305: U$1.2 v20.32,13.97 | v15.88,14.61 13.97,12.7 13.97,11.43 15.24,10.16 C4.1
  Top 0.406: U$1.2 U$1.4 | U$1.4 20.26,21.59 13.97,21.59 8.89,26.67 LED2.A 5.23,26.82 8.89,30.48 8.89,32.89 R14.1 | U$1.4 v20.32,26.67
  Bottom 0.127: v41.91,34.29 42.55,34.29 43.81,35.56 v43.81,36.83 | v48.9,38.1 48.26,38.1 45.72,40.64 | v43.18,45.09 44.45,44.45 46.99,41.91 | v66.04,31.75 67.31,34.29 70.17,34.29 XB1.1 | v34.29,49.53 34.29,50.8 v35.56,52.07
  Bottom 0.305: v20.32,13.97 v15.88,14.61
  Bottom 0.406: v20.32,26.67 22.86,31.75 35.56,31.75 45.72,40.64 46.99,41.91 50.8,45.72 v52.07,45.72